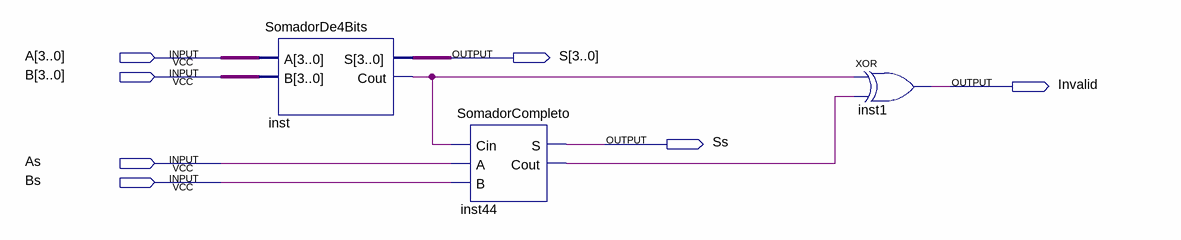
[diagram p0: schematic sheet]
// Quartus schematic ComplementoDe2.bdf as structural Verilog: 3 symbols, 7 pins
module ComplementoDe2 (
  input  [3:0] A,
  input  [3:0] B,
  input  As,
  input  Bs,
  output [3:0] S,
  output Invalid,
  output Ss
);

  wire inst44_cout, inst_cout;

  SomadorDe4Bits inst (.A(A), .B(B), .S(S), .Cout(inst_cout));
  SomadorCompleto inst44 (.Cin(inst_cout), .A(As), .B(Bs), .S(Ss), .Cout(inst44_cout));
  xor inst1 (Invalid, inst_cout, inst44_cout);
endmodule
